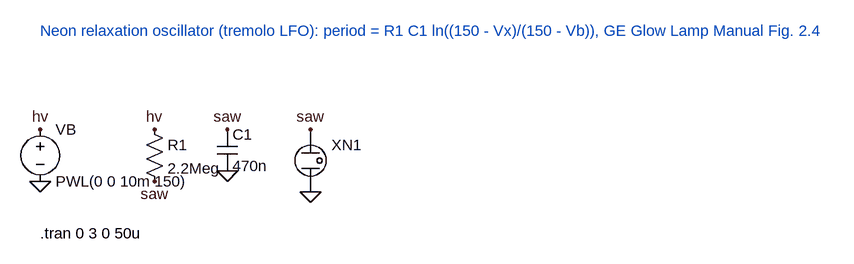
[diagram p0: schematic demo_neon.asc]
demo_neon.asc, the LTspice schematic file:
Version 4
SHEET 1 700 400
FLAG 0 112 hv
FLAG 0 192 0
FLAG 176 112 hv
FLAG 176 192 saw
FLAG 288 112 saw
FLAG 288 176 0
FLAG 416 112 saw
FLAG 416 208 0
SYMBOL voltage 0 96 R0
SYMATTR InstName VB
SYMATTR Value PWL(0 0 10m 150)
SYMBOL res 160 96 R0
SYMATTR InstName R1
SYMATTR Value 2.2Meg
SYMBOL cap 272 112 R0
SYMATTR InstName C1
SYMATTR Value 470n
SYMBOL NE2 400 96 R0
SYMATTR InstName XN1
TEXT 0 272 Left 2 !.tran 0 3 0 50u
TEXT 0 -40 Left 2 ;Neon relaxation oscillator (tremolo LFO): period = R1 C1 ln((150 - Vx)/(150 - Vb)), GE Glow Lamp Manual Fig. 2.4

The netlist it stands for:
* demo_neon.asc
VB hv 0 PWL(0 0 10m 150)
R1 hv saw 2.2Meg
C1 saw 0 470n
XXN1 saw 0 NE2  ; pins A K
.tran 0 3 0 50u
* Neon relaxation oscillator (tremolo LFO): period = R1 C1 ln((150 - Vx)/(150 - Vb)), GE Glow Lamp Manual Fig. 2.4
.lib neon.sub
.backanno
.end